# EAGLE design programmer_pcb2 (EAGLE 9.6.2)
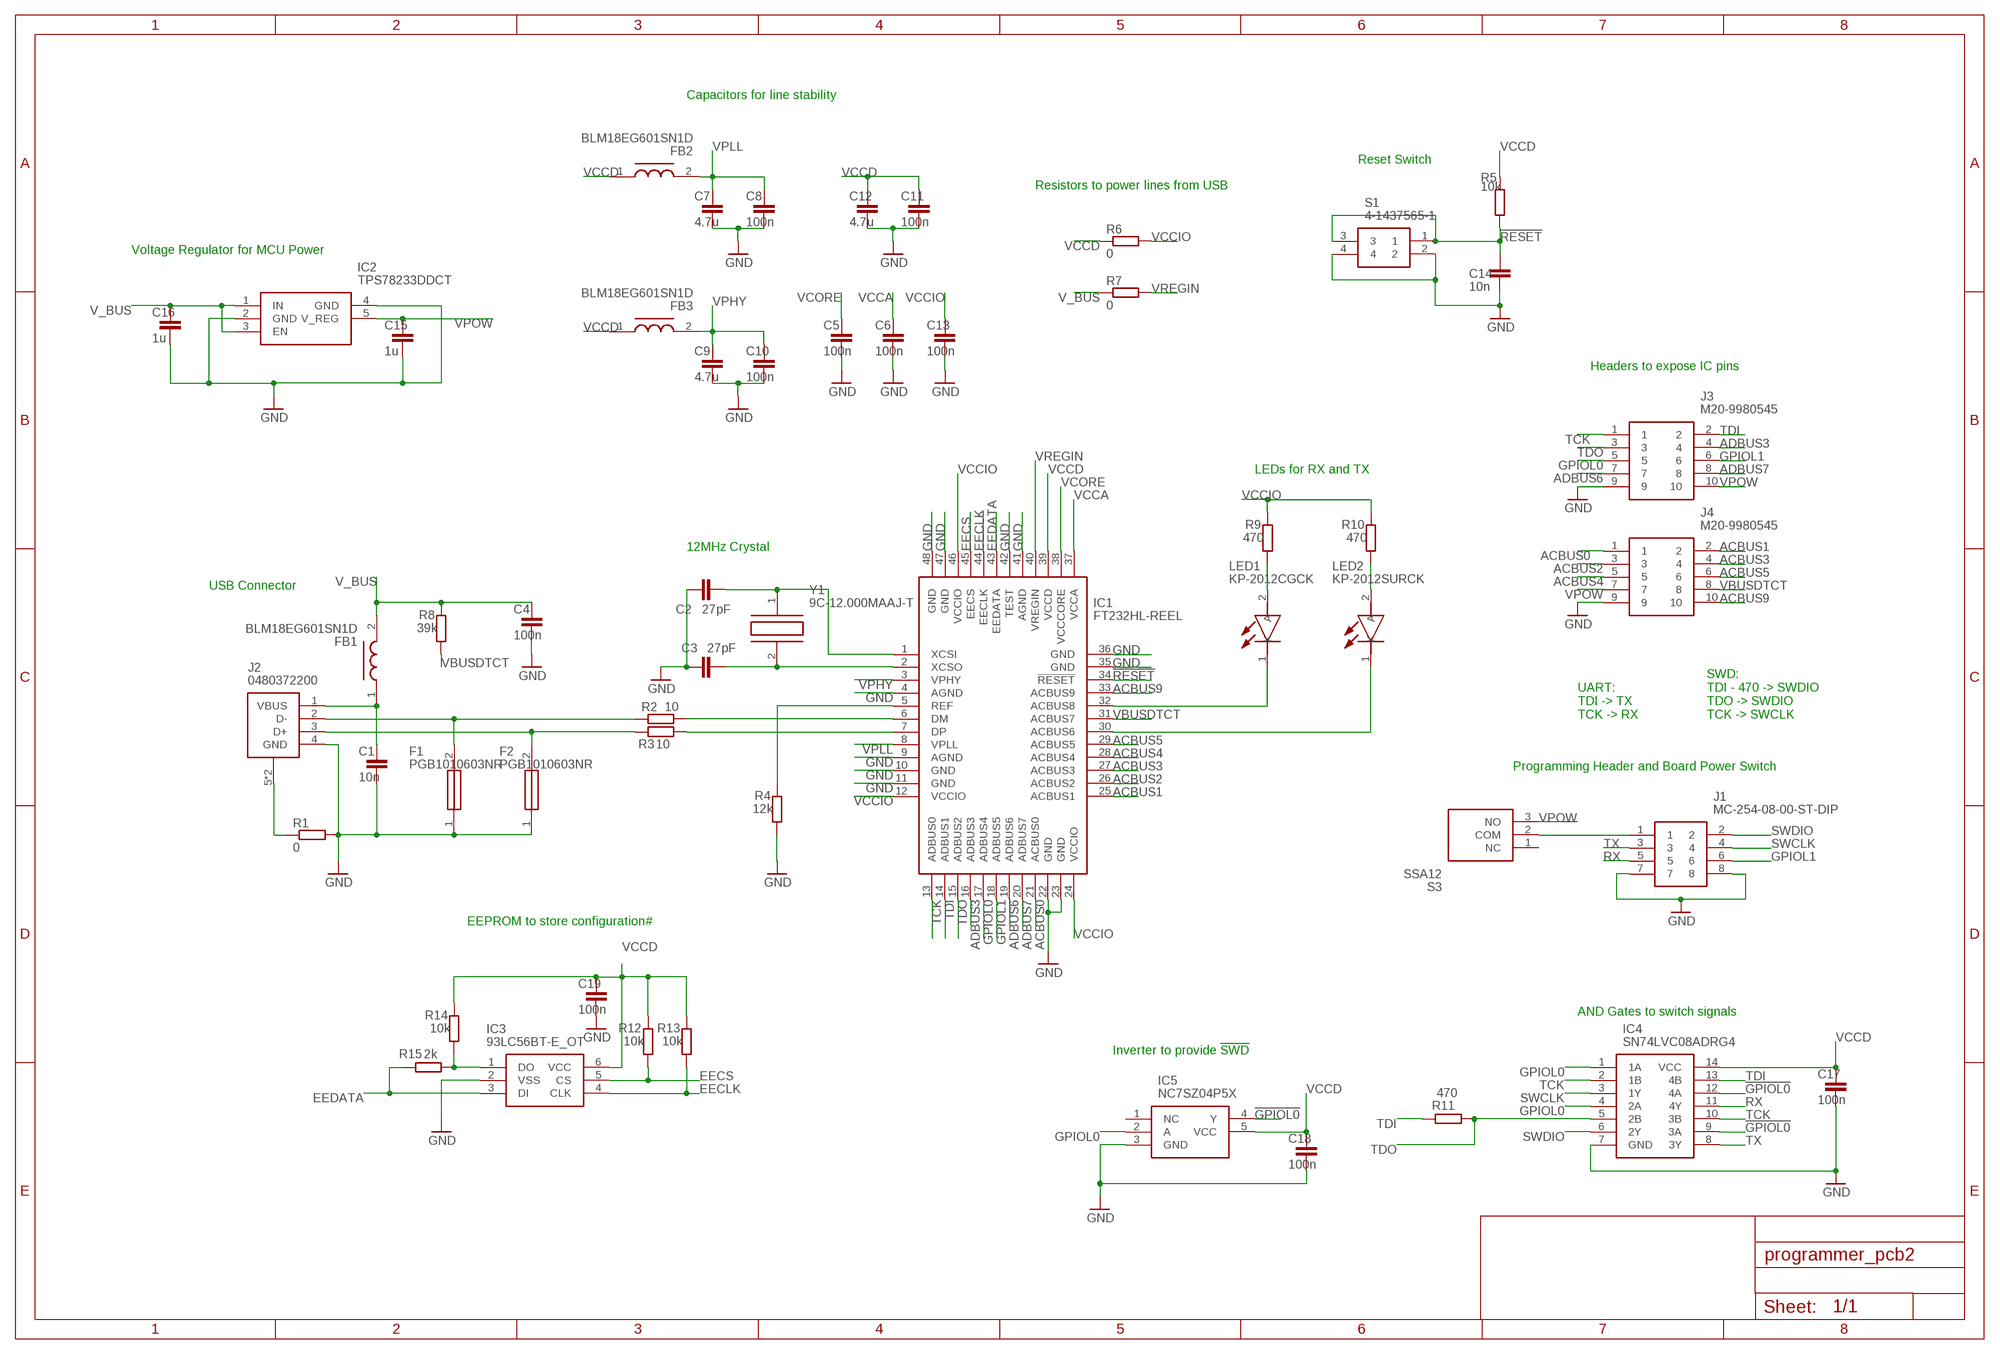
[diagram p0: schematic, sheet 1]

## Parts
C1  10n  C-EUC0805  [C0805]
C2  27pF  C-EUC0805  [C0805]
C3  27pF  C-EUC0805  [C0805]
C4  100n  C-EUC0805  [C0805]
C5  100n  C-EUC0805  [C0805]
C6  100n  C-EUC0805  [C0805]
C7  4.7u  C-EUC0805  [C0805]
C8  100n  C-EUC0805  [C0805]
C9  4.7u  C-EUC0805  [C0805]
C10  100n  C-EUC0805  [C0805]
C11  100n  C-EUC0805  [C0805]
C12  4.7u  C-EUC0805  [C0805]
C13  100n  C-EUC0805  [C0805]
C14  10n  C-EUC0805  [C0805]
C15  1u  C-EUC0805  [C0805]
C16  1u  C-EUC0805  [C0805]
C17  100n  C-EUC0805  [C0805]
C18  100n  C-EUC0805  [C0805]
C19  100n  C-EUC0805  [C0805]
F1  PGB1010603NR  [FUSC1708X36N]
F2  PGB1010603NR  [FUSC1708X36N]
FB1  BLM18EG601SN1D  [BLM18EG121SH1D]
FB2  BLM18EG601SN1D  [BLM18EG121SH1D]
FB3  BLM18EG601SN1D  [BLM18EG121SH1D]
IC1  FT232HL-REEL  [QFP50P900X900X160-48N]
IC2  TPS78233DDCT  [SOT95P280X110-5N]
IC3  93LC56BT-E_OT  [SOT95P270X145-6N]
IC4  SN74LVC08ADRG4  [SOIC127P600X175-14N]
IC5  NC7SZ04P5X  [SOT65P210X110-5N]
J1  MC-254-08-00-ST-DIP  [MC2540800STDIP]
J2  0480372200  [0480372200]
J3  M20-9980545  [HDRV10W80P254_2X5_1270X508X864]
J4  M20-9980545  [HDRV10W80P254_2X5_1270X508X864]
LED1  KP-2012CGCK  [LEDC2012X110N]
LED2  KP-2012SURCK  [LEDC2012X110N]
R1  0  R-EU_R0603  [R0603]
R2  10  R-EU_R0603  [R0603]
R3  10  R-EU_R0603  [R0603]
R4  12k  R-EU_R0603  [R0603]
R5  10k  R-EU_R0603  [R0603]
R6  0  R-EU_R0603  [R0603]
R7  0  R-EU_R0603  [R0603]
R8  39k  R-EU_R0603  [R0603]
R9  470  R-EU_R0603  [R0603]
R10  470  R-EU_R0603  [R0603]
R11  470  R-EU_R0603  [R0603]
R12  10k  R-EU_R0603  [R0603]
R13  10k  R-EU_R0603  [R0603]
R14  10k  R-EU_R0603  [R0603]
R15  2k  R-EU_R0603  [R0603]
S1  4-1437565-1  [FSM-SWITCH]
S3  SSA12  [SSA12]
Y1  9C-12.000MAAJ-T  [SMD-HC-49-S]

## Nets
!GPIOL0: IC4.9(3A) IC4.12(4A) IC5.4(Y)
!RESET: C14.1 IC1.34(!RESET) R5.1 S1.1 S1.3
ACBUS0: IC1.21(ACBUS0) J4.1
ACBUS1: IC1.25(ACBUS1) J4.2
ACBUS2: IC1.26(ACBUS2) J4.3
ACBUS3: IC1.27(ACBUS3) J4.4
ACBUS4: IC1.28(ACBUS4) J4.5
ACBUS5: IC1.29(ACBUS5) J4.6
ACBUS9: IC1.33(ACBUS9) J4.10
ADBUS3: IC1.16(ADBUS3) J3.4
ADBUS6: IC1.19(ADBUS6) J3.7
ADBUS7: IC1.20(ADBUS7) J3.8
EECLK: IC1.44(EECLK) IC3.4(CLK) R13.1
EECS: IC1.45(EECS) IC3.5(CS) R12.1
EEDATA: IC1.43(EEDATA) IC3.3(DI) R15.1
GND: C1.2 C2.1 C3.1 C4.2 C5.2 C6.2 C7.2 C8.2 C9.2 C10.2 C11.2 C12.2 C13.2 C14.2 C15.2 C16.2 C17.2 C18.2 C19.2 F1.1 F2.1 IC1.4(AGND) IC1.9(AGND) IC1.10(GND) IC1.11(GND) IC1.22(GND) IC1.23(GND) IC1.35(GND) IC1.36(GND) IC1.41(AGND) IC1.42(TEST) IC1.47(GND) IC1.48(GND) IC2.2(GND) IC2.4(GND) IC3.2(VSS) IC4.7(GND) IC5.3(GND) J1.7 J1.8 J2.4(GND) J3.9 J4.9 R1.2 R4.1 S1.2 S1.4
GPIOL0: IC1.17(ADBUS4) IC4.1(1A) IC4.4(2A) IC5.2(A) J3.5
GPIOL1: IC1.18(ADBUS5) J1.6 J3.6
N$1: J2.5(SLD) J2.6(SLD) R1.1
N$2: C1.1 FB1.1 J2.1(VBUS)
N$3: F1.2 J2.2(D-) R2.1
N$4: F2.2 J2.3(D+) R3.1
N$5: IC1.7(DP) R3.2
N$6: IC1.6(DM) R2.2
N$7: C2.2 IC1.1(XCSI) Y1.1
N$8: C3.2 IC1.2(XCSO) Y1.2
N$9: IC1.5(REF) R4.2
N$11: J1.1 S3.2(COM)
N$12: IC1.30(ACBUS6) LED2.1(K)
N$14: IC1.32(ACBUS8) LED1.1(K)
N$15: LED1.2(A) R9.1
N$16: LED2.2(A) R10.1
N$20: IC3.1(DO) R14.1 R15.2
RX: IC4.11(4Y) J1.5
SWCLK: IC4.3(1Y) J1.4
SWDIO: IC4.6(2Y) J1.2
TCK: IC1.13(ADBUS0) IC4.2(1B) IC4.10(3B) J3.1
TDI: IC1.14(ADBUS1) IC4.13(4B) J3.2 R11.1
TDO: IC1.15(ADBUS2) IC4.5(2B) J3.3 R11.2
TX: IC4.8(3Y) J1.3
V_BUS: C4.1 C16.1 FB1.2 IC2.1(IN) IC2.3(EN) R7.1 R8.2
VBUSDTCT: IC1.31(ACBUS7) J4.8 R8.1
VCCA: C6.1 IC1.37(VCCA)
VCCD: C11.1 C12.1 C17.1 C18.1 C19.1 FB2.1 FB3.1 IC1.39(VCCD) IC3.6(VCC) IC4.14(VCC) IC5.5(VCC) R5.2 R6.1 R12.2 R13.2 R14.2
VCCIO: C13.1 IC1.12(VCCIO) IC1.24(VCCIO) IC1.46(VCCIO) R6.2 R9.2 R10.2
VCORE: C5.1 IC1.38(VCCCORE)
VPHY: C9.1 C10.1 FB3.2 IC1.3(VPHY)
VPLL: C7.1 C8.1 FB2.2 IC1.8(VPLL)
VPOW: C15.1 IC2.5(V_REG) J3.10 J4.7 S3.3(NO)
VREGIN: IC1.40(VREGIN) R7.2
Unconnected: IC5.1(NC) S3.1(NC)

## Notes on the sheet
- Capacitors for line stability
- Reset Switch
- Resistors to power lines from USB
- Voltage Regulator for MCU Power
- Headers to expose IC pins
- LEDs for RX and TX
- 12MHz Crystal
- USB Connector
- UART: 
  TDI -> TX
  TCK -> RX
- SWD:
  TDI - 470 -> SWDIO
  TDO -> SWDIO
  TCK -> SWCLK
- Programming Header and Board Power Switch
- EEPROM to store configuration#
- AND Gates to switch signals
- Inverter to provide !SWD

## Library data of the parts
C1-C19 = rcl:C-EU: CAPACITOR, European symbol; SPICEPREFIX: C
F1 F2 = SamacSys_Parts:PGB1010603NR: Suppressor Pulseguard 0603 ESD 24Vdc PG Littelfuse 24 V dc PGB1 ESD Suppressor, Surface Mount Mounting Source: Datasheet <https://componentsearchengine.com/Datasheets/2/PGB1010603NR.pdf>; ARROW_PART_NUMBER: PGB1010603NR; ARROW_PRICE-STOCK: https://www.arrow.com/en/products/pgb1010603nr/littelfuse; DESCRIPTION: Suppressor Pulseguard 0603 ESD 24Vdc PG Littelfuse 24 V dc PGB1 ESD Suppressor, Surface Mount Mounting; HEIGHT: 0.36mm; MANUFACTURER_NAME: LITTELFUSE; MANUFACTURER_PART_NUMBER: PGB1010603NR; MOUSER_PART_NUMBER: 576-PGB1010603NR; MOUSER_PRICE-STOCK: https://www.mouser.co.uk/ProductDetail/Littelfuse/PGB1010603NR?qs=gu7KAQ731UTJOoBJUwB8FA%3D%3D
FB1-FB3 = SamacSys_Parts:BLM18EG601SN1D: Murata Ferrite Bead (Chip Ferrite Bead), 1.6 x 0.8 x 0.8mm (0603), 600 impedance at 100 MHz Source: Datasheet <https://componentsearchengine.com/Datasheets/1/BLM18EG601SN1D.pdf>; DESCRIPTION: Murata Ferrite Bead (Chip Ferrite Bead), 1.6 x 0.8 x 0.8mm (0603), 600 impedance at 100 MHz; HEIGHT: 0.95mm; MANUFACTURER_NAME: Murata Electronics; MANUFACTURER_PART_NUMBER: BLM18EG601SN1D; MOUSER_PART_NUMBER: 81-BLM18EG601SN1D; MOUSER_PRICE-STOCK: https://www.mouser.com/Search/Refine.aspx?Keyword=81-BLM18EG601SN1D
IC1 = SamacSys_Parts:FT232HL-REEL: USB 2.0 to UART/FIFO Interface, LQFP48 FTDI Chip FT232HL-REEL Universal Asynchronous Receiver & Transmitter RS232, RS422, RS485 UART 12Mbit/s, 1.8 V, 3.3 V Source: Datasheet <http://www.ftdichip.com/Support/Documents/DataSheets/ICs/DS_FT232H.pdf>; DESCRIPTION: USB 2.0 to UART/FIFO Interface, LQFP48 FTDI Chip FT232HL-REEL Universal Asynchronous Receiver & Transmitter RS232, RS422, RS485 UART 12Mbit/s, 1.8 V, 3.3 V; HEIGHT: 1.6mm; MANUFACTURER_NAME: FTDI Chip; MANUFACTURER_PART_NUMBER: FT232HL-REEL; MOUSER_PART_NUMBER: 895-FT232HL-REEL; MOUSER_PRICE-STOCK: https://www.mouser.co.uk/ProductDetail/FTDI/FT232HL-REEL?qs=rzPzygjq8vIanTFlYsBQCw%3D%3D
IC2 = SamacSys_Parts:TPS78233DDCT: TPS78233DDCT, Low Dropout Voltage Regulator, 0.15A, 3.3V +/-2%, 2.2 to 5.5Vin, 0.5W, 5-Pin SOT Source: Datasheet <http://www.ti.com/lit/ds/symlink/tps78233.pdf>; DESCRIPTION: TPS78233DDCT, Low Dropout Voltage Regulator, 0.15A, 3.3V +/-2%, 2.2 to 5.5Vin, 0.5W, 5-Pin SOT; HEIGHT: 1.1mm; MANUFACTURER_NAME: Texas Instruments; MANUFACTURER_PART_NUMBER: TPS78233DDCT; MOUSER_PART_NUMBER: 595-TPS78233DDCT; MOUSER_PRICE-STOCK: https://www.mouser.co.uk/ProductDetail/Texas-Instruments/TPS78233DDCT?qs=IDSsxkoac0yhGoy0%252BR8zmA%3D%3D
IC3 = SamacSys_Parts:93LC56BT-E_OT: Microchip 93LC56BT-E/OT, 2kbit EEPROM Memory, 400ns 6-Pin SOT-23 Serial-Microwire Source: Datasheet <http://ww1.microchip.com/downloads/en/devicedoc/21794g.pdf>; ARROW_PART_NUMBER: 93LC56BT-E/OT; ARROW_PRICE-STOCK: https://www.arrow.com/en/products/93lc56bt-eot/microchip-technology; DESCRIPTION: Microchip 93LC56BT-E/OT, 2kbit EEPROM Memory, 400ns 6-Pin SOT-23 Serial-Microwire; HEIGHT: 1.45mm; MANUFACTURER_NAME: Microchip; MANUFACTURER_PART_NUMBER: 93LC56BT-E/OT; MOUSER_PART_NUMBER: 579-93LC56BT-E/OT; MOUSER_PRICE-STOCK: https://www.mouser.co.uk/ProductDetail/Microchip-Technology/93LC56BT-E-OT?qs=mKuojOqe%252BqOr0HXN84QqHA%3D%3D
IC4 = SamacSys_Parts:SN74LVC08ADRG4: Quadruple 2-Input Positive-AND Gate Source: Datasheet <http://www.ti.com/lit/gpn/SN74LVC08A>; ARROW_PART_NUMBER: SN74LVC08ADRG4; ARROW_PRICE-STOCK: https://www.arrow.com/en/products/sn74lvc08adrg4/texas-instruments; DESCRIPTION: Quadruple 2-Input Positive-AND Gate; HEIGHT: 1.75mm; MANUFACTURER_NAME: Texas Instruments; MANUFACTURER_PART_NUMBER: SN74LVC08ADRG4; MOUSER_PART_NUMBER: 595-SN74LVC08ADRG4; MOUSER_PRICE-STOCK: https://www.mouser.com/Search/Refine.aspx?Keyword=595-SN74LVC08ADRG4
IC5 = SamacSys_Parts:NC7SZ04P5X: Inverter 1 Channel CMOS 5 Pin SC-70 Source: Datasheet <http://docs-emea.rs-online.com/webdocs/0f9b/0900766b80f9b618.pdf>; ARROW_PART_NUMBER: NC7SZ04P5X; ARROW_PRICE-STOCK: https://www.arrow.com/en/products/nc7sz04p5x/on-semiconductor; DESCRIPTION: Inverter 1 Channel CMOS 5 Pin SC-70; HEIGHT: 1.1mm; MANUFACTURER_NAME: ON Semiconductor; MANUFACTURER_PART_NUMBER: NC7SZ04P5X; MOUSER_PART_NUMBER: 512-NC7SZ04P5X; MOUSER_PRICE-STOCK: https://www.mouser.co.uk/ProductDetail/ON-Semiconductor-Fairchild/NC7SZ04P5X?qs=CR8BwU6haLeoOKbTbWr5WQ%3D%3D
J1 = SamacSys_Parts:MC-254-08-00-ST-DIP: CONNECTOR, HEADER, 8POS, 2ROW, 2.54MM; Pitch Spacing:2.54mm; No. of Contacts:8Contacts; Gender:Header; Product Range:-; Contact Termination Type:Through Hole; No. of Rows:2Rows; Contact Plating:Gold Plated Contacts RoHS Compliant: Yes Source: Datasheet <https://componentsearchengine.com/Datasheets/2/MC-254-08-00-ST-DIP.pdf>; ARROW_PART_NUMBER: MC-254-08-00-ST-DIP; DESCRIPTION: CONNECTOR, HEADER, 8POS, 2ROW, 2.54MM; Pitch Spacing:2.54mm; No. of Contacts:8Contacts; Gender:Header; Product Range:-; Contact Termination Type:Through Hole; No. of Rows:2Rows; Contact Plating:Gold Plated Contacts RoHS Compliant: Yes; HEIGHT: 9.1mm; MANUFACTURER_NAME: MULTICOMP; MANUFACTURER_PART_NUMBER: MC-254-08-00-ST-DIP
J2 = SamacSys_Parts:0480372200: CONN PLUG USB A 4POS SMD R/A Source: Datasheet <https://www.molex.com/pdm_docs/sd/480372200_sd.pdf>; ARROW_PART_NUMBER: 0480372200; ARROW_PRICE-STOCK: https://www.arrow.com/en/products/0480372200/molex; DESCRIPTION: CONN PLUG USB A 4POS SMD R/A; HEIGHT: 4mm; MANUFACTURER_NAME: Molex; MANUFACTURER_PART_NUMBER: 0480372200; MOUSER_PART_NUMBER: N/A; MOUSER_PRICE-STOCK: https://www.mouser.co.uk/ProductDetail/Molex/0480372200?qs=PBcRNPEHKspH5weIJRN3iw%3D%3D
J3 J4 = SamacSys_Parts:M20-9980545: M20 Header, Pin, Dil, Vertical, 5+5 W HARWIN M20 Series, 2.54mm Pitch 10 Way 2 Row Straight Pin Header, Through Hole, Solder Termination Source: Datasheet <https://componentsearchengine.com/Datasheets/2/M20-9980545.pdf>; ARROW_PART_NUMBER: M20-9980545; DESCRIPTION: M20 Header, Pin, Dil, Vertical, 5+5 W HARWIN M20 Series, 2.54mm Pitch 10 Way 2 Row Straight Pin Header, Through Hole, Solder Termination; HEIGHT: 8.64mm; MANUFACTURER_NAME: Harwin; MANUFACTURER_PART_NUMBER: M20-9980545; MOUSER_PART_NUMBER: 855-M20-9980545; MOUSER_PRICE-STOCK: https://www.mouser.co.uk/ProductDetail/Harwin/M20-9980545?qs=%252Bk6%2F5FB6qrlY8xJEYbERXQ%3D%3D
LED1 = SamacSys_Parts:KP-2012CGCK: Green Chip LED 2.0x1.25mm Kingbright KP-2012CGCK Green LED, 570 nm, 2012 (0805), Rectangle Lens SMD Package Source: Datasheet <https://componentsearchengine.com/Datasheets/2/KP-2012CGCK.pdf>; DESCRIPTION: Green Chip LED 2.0x1.25mm Kingbright KP-2012CGCK Green LED, 570 nm, 2012 (0805), Rectangle Lens SMD Package; HEIGHT: 1.1mm; MANUFACTURER_NAME: Kingbright; MANUFACTURER_PART_NUMBER: KP-2012CGCK; MOUSER_PART_NUMBER: N/A; MOUSER_PRICE-STOCK: https://www.mouser.com/Search/Refine.aspx?Keyword=N%2FA; RS_PART_NUMBER: 8610037P; RS_PRICE-STOCK: http://uk.rs-online.com/web/p/products/8610037P
LED2 = SamacSys_Parts:KP-2012SURCK: Red Chip LED 2.0x1.25mm Kingbright KPT-2012SURCK Red LED, 2012 (0805), Rectangle Lens SMD Package; DESCRIPTION: Green Chip LED 2.0x1.25mm Kingbright KP-2012CGCK Green LED, 570 nm, 2012 (0805), Rectangle Lens SMD Package; HEIGHT: 1.1mm; MANUFACTURER_NAME: Kingbright; MANUFACTURER_PART_NUMBER: KP-2012CGCK; MOUSER_PART_NUMBER: N/A; MOUSER_PRICE-STOCK: https://www.mouser.com/Search/Refine.aspx?Keyword=N%2FA; RS_PART_NUMBER: 8610037P; RS_PRICE-STOCK: http://uk.rs-online.com/web/p/products/8610037P
R1-R15 = rcl:R-EU_: RESISTOR, European symbol; SPICEPREFIX: R
S1 = SamacSys_Parts:4-1437565-1: 6x6mm SMD tactile switch,5mm H 1.6N Black Button Tactile Switch, SPST-NO 0.05 A@ 12 V dc 1.4mm Source: Datasheet <http://uk.rs-online.com/web/p/products/4791508P>; ALLIED_NUMBER: R1117787; DESCRIPTION: 6x6mm SMD tactile switch,5mm H 1.6N Black Button Tactile Switch, SPST-NO 0.05 A@ 12 V dc 1.4mm; HEIGHT: mm; MANUFACTURER_NAME: TE Connectivity; MANUFACTURER_PART_NUMBER: 4-1437565-1; RS_PART_NUMBER: 4791508P; RS_PRICE-STOCK: http://uk.rs-online.com/web/p/products/4791508P
S3 = SamacSys_Parts:SSA12: Slide switch,PCB,SPDT,2 pos,vertical mnt Source: Datasheet <http://uk.rs-online.com/web/p/products/7182326P>; ALLIED_NUMBER: 70155886; DESCRIPTION: Slide switch,PCB,SPDT,2 pos,vertical mnt; HEIGHT: 5.664mm; MANUFACTURER_NAME: TE Connectivity; MANUFACTURER_PART_NUMBER: SSA12; RS_PART_NUMBER: 7182326P; RS_PRICE-STOCK: http://uk.rs-online.com/web/p/products/7182326P
Y1 = SamacSys_Parts:9C-12.000MAAJ-T: TXC - 9C-8.000MAAJ-T - XTAL, 8.000MHZ, 18PF, SMD, HC-49S Source: Datasheet <http://www.txccrystal.com/images/pdf/9c.pdf>; ARROW_PART_NUMBER: 9C-8.000MAAJ-T; ARROW_PRICE-STOCK: https://www.arrow.com/en/products/9c-8.000maaj-t/txc-corporation; DESCRIPTION: TXC - 9C-8.000MAAJ-T - XTAL, 8.000MHZ, 18PF, SMD, HC-49S; HEIGHT: mm; MANUFACTURER_NAME: TXC; MANUFACTURER_PART_NUMBER: 9C-8.000MAAJ-T; MOUSER_PART_NUMBER: 717-9C-8.000MAAJ-T; MOUSER_PRICE-STOCK: https://www.mouser.co.uk/ProductDetail/TXC-Corporation/9C-8000MAAJ-T?qs=65dIHZNch5tkz4amJINljg%3D%3D

## Board
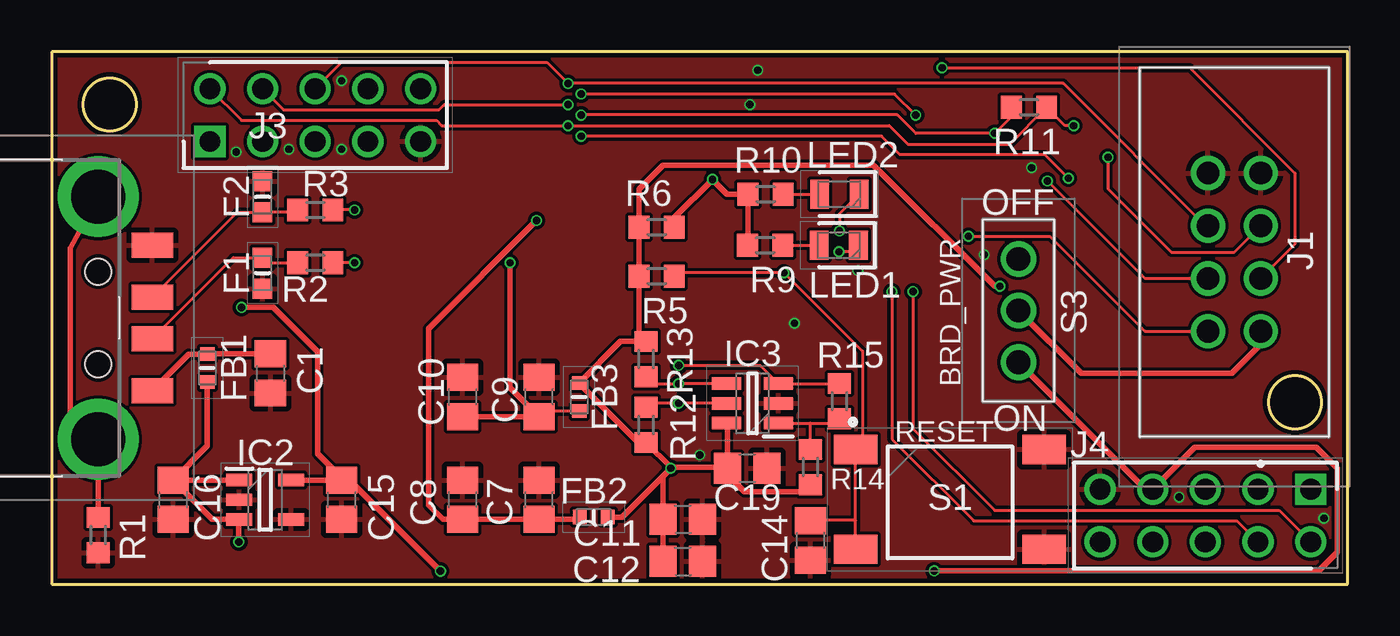
[diagram p1: board, top side]
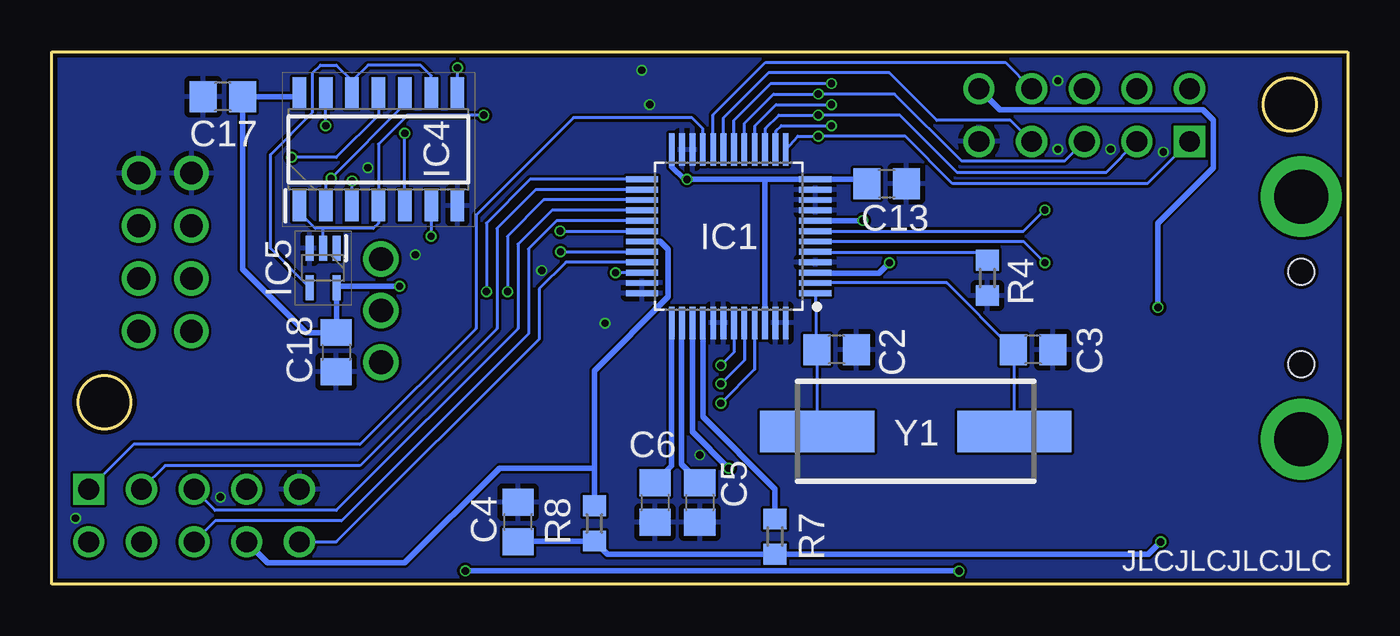
[diagram p2: board, bottom side, seen from below]

Size 62.48 x 25.65 mm. Coordinates in mm from the lower left corner, seen from the top.
Outline: 0,25.65 0,0 62.48,0 62.48,25.65 0,25.65
Outline: circle at 2.79,23.11 radius 1.27
Outline: circle at 59.94,8.76 radius 1.27
Copper layers (1*16): Top 0.035559375mm / dielectric 1.6mm / Bottom 0.035559375mm
Design rules "jlcpcb2layer": minimum track width 5mil, minimum drill 12mil, track to track 5mil, track to pad 5mil, pad to pad 5mil, via to via 5mil, smd to smd 5mil, copper to edge 8mil, drill to drill 6mil, minimum pad ring 5mil, minimum via ring 3mil, stop-mask expansion 2.5mil, vias tented up to drill 0mil, thermal gap 10mil

### Footprints (pad centres in the part's own frame; a part is rotated, then mirrored left to right if it is on the bottom)
C0805 = smd 1.3 x 1.5: 1 -0.95,0; 2 0.95,0
FUSC1708X36N = smd 0.97 x 0.94: 1 -0.75,0; 2 0.75,0
BLM18EG121SH1D = smd 0.65 x 0.7: 1 -0.675,0; 2 0.675,0
QFP50P900X900X160-48N = smd 1.559 x 0.28: 1 -4.178,2.75; 2 -4.178,2.25; 3 -4.178,1.75; 4 -4.178,1.25; 5 -4.178,0.75; 6 -4.178,0.25; 7 -4.178,-0.25; 8 -4.178,-0.75; 9 -4.178,-1.25; 10 -4.178,-1.75; 11 -4.178,-2.25; 12 -4.178,-2.75; 25 4.178,-2.75; 26 4.178,-2.25; 27 4.178,-1.75; 28 4.178,-1.25; 29 4.178,-0.75; 30 4.178,-0.25; 31 4.178,0.25; 32 4.178,0.75; 33 4.178,1.25; 34 4.178,1.75; 35 4.178,2.25; 36 4.178,2.75 | smd 0.28 x 1.559: 13 -2.75,-4.178; 14 -2.25,-4.178; 15 -1.75,-4.178; 16 -1.25,-4.178; 17 -0.75,-4.178; 18 -0.25,-4.178; 19 0.25,-4.178; 20 0.75,-4.178; 21 1.25,-4.178; 22 1.75,-4.178; 23 2.25,-4.178; 24 2.75,-4.178; 37 2.75,4.178; 38 2.25,4.178; 39 1.75,4.178; 40 1.25,4.178; 41 0.75,4.178; 42 0.25,4.178; 43 -0.25,4.178; 44 -0.75,4.178; 45 -1.25,4.178; 46 -1.75,4.178; 47 -2.25,4.178; 48 -2.75,4.178
SOT95P280X110-5N = smd 1.25 x 0.6: 1 -1.25,0.95; 2 -1.25,0; 3 -1.25,-0.95; 4 1.25,-0.95; 5 1.25,0.95
SOT95P270X145-6N = smd 1.4 x 0.6: 1 -1.25,0.95; 2 -1.25,0; 3 -1.25,-0.95; 4 1.25,-0.95; 5 1.25,0; 6 1.25,0.95
SOIC127P600X175-14N = smd 1.525 x 0.65: 1 -2.712,3.81; 2 -2.712,2.54; 3 -2.712,1.27; 4 -2.712,0; 5 -2.712,-1.27; 6 -2.712,-2.54; 7 -2.712,-3.81; 8 2.712,-3.81; 9 2.712,-2.54; 10 2.712,-1.27; 11 2.712,0; 12 2.712,1.27; 13 2.712,2.54; 14 2.712,3.81
SOT65P210X110-5N = smd 1.2 x 0.4: 1 -0.95,0.65; 2 -0.95,0; 3 -0.95,-0.65; 4 0.95,-0.65; 5 0.95,0.65
MC2540800STDIP = drill 1.1 pad 1.65: 1 0,0; 2 0,2.54; 3 2.54,0; 4 2.54,2.54; 5 5.08,0; 6 5.08,2.54; 7 7.62,0; 8 7.62,2.54
0480372200 = smd 1.2 x 2: 1 3.5,10.175; 2 1,10.175; 3 -1,10.175; 4 -3.5,10.175 | drill 2.596 pad 3.894: 5 -5.85,7.575; 6 5.85,7.575 | hole 1.25: 2.235,7.569; -2.235,7.569
HDRV10W80P254_2X5_1270X508X864 = drill 1 pad 1.5 square: 1 0,0 | drill 1 pad 1.5: 2 0,2.54; 3 2.54,0; 4 2.54,2.54; 5 5.08,0; 6 5.08,2.54; 7 7.62,0; 8 7.62,2.54; 9 10.16,0; 10 10.16,2.54
LEDC2012X110N = smd 0.9 x 1.4: 1 -0.95,0; 2 0.95,0
R0603 = smd 1 x 1.1: 1 -0.85,0; 2 0.85,0
FSM-SWITCH = smd 1.4 x 2.1: 1 2.55,4.55; 2 2.55,-4.55; 3 -2.25,4.55; 4 -2.25,-4.55
SSA12 = drill 1.143 pad 1.715: 1 0,0; 2 2.489,0; 3 4.978,0
SMD-HC-49-S = smd 5.5 x 2: 1 -4.75,0; 2 4.75,0

### Placement (x,y rotation side)
C1  10.54,10.16 270 top
C2  24.64,11.3 180 bottom
C3  15.16,11.3 180 bottom
C4  40.01,3 90 bottom
C5  31.24,3.94 270 bottom
C6  33.4,3.94 270 bottom
C7  23.5,4.06 90 top
C8  19.81,4.06 90 top
C9  23.5,9.02 90 top
C10  19.81,9.02 90 top
C11  30.43,3.12 0 top
C12  30.43,1.09 0 top
C13  22.23,19.3 0 bottom
C14  36.58,2.11 270 top
C15  13.97,4.06 270 top
C16  5.84,4.06 270 top
C17  54.23,23.5 180 bottom
C18  48.77,11.18 270 bottom
C19  33.53,5.59 0 top
F1  10.16,14.99 90 top
F2  10.16,18.67 270 top
FB1  7.49,10.41 270 top
FB2  26.14,3.23 180 top
FB3  25.43,9.02 270 top
IC1  29.84,16.76 180 bottom
IC2  10.29,4.06 0 top
IC3  33.78,8.71 180 top
IC4  46.74,20.95 90 bottom
IC5  49.4,15.24 270 bottom
J1  58.29,12.19 90 top
J2  -5.33,12.83 270 top
J3  7.62,21.34 0 top
J4  60.71,4.57 180 top
LED1  37.95,16.33 180 top
LED2  37.97,18.8 180 top
R1  2.24,2.36 270 top
R2  12.7,15.49 0 top
R3  12.7,18.03 0 top
R4  17.37,14.76 90 bottom
R5  29.16,14.83 180 top
R6  29.16,17.2 0 top
R7  27.61,2.29 90 bottom
R8  36.32,2.92 270 bottom
R9  34.39,16.33 180 top
R10  34.42,18.8 180 top
R11  47.12,22.99 180 top
R12  28.65,7.67 270 top
R13  28.65,10.85 90 top
R14  36.58,5.64 270 top
R15  37.97,8.81 270 top
S1  43.31,3.94 90 top
S3  46.61,15.67 270 top
Y1  20.83,7.37 0 bottom

### Tracks (layer width: path | path; a pad name or v marks a point on that pad's centre or on a via)
!GPIOL0
  Bottom 0.152: IC5.4 51.94,16.18 51.94,20.7 49.91,22.73 49.91,24.64 49.53,25.02 48.77,25.02 48.01,24.26 | 48.01,24.26 IC4.12 | IC4.9 44.2,24.51 44.7,25.02 47.24,25.02 48.01,24.26
!RESET  (via drill 0.35)
  Top 0.152: S1.3 38.76,3.07 | 38.76,3.07 S1.1 39.09,6.82 39.09,11.23 v35.31,15.01 30.19,15.01 R5.1 | 38.76,3.07 36.59,3.07 C14.1
  Bottom 0.152: IC1.34 v35.3,15.01 v35.31,15.01
ACBUS0
  Bottom 0.152: IC1.21 31.09,21.95 31.62,22.48 37.34,22.48 42.04,17.78 42.04,12.32 47.62,6.73 58.55,6.73 J4.1
ACBUS1  (via drill 0.35)
  Top 0.152: v41.53,14.1 41.53,7.49 45.47,3.56 59.18,3.56 J4.2
  Bottom 0.152: IC1.25 39.41,19.51 41.53,17.4 v41.53,14.1
ACBUS2
  Bottom 0.152: IC1.26 39.15,19.01 41.02,17.14 41.02,12.32 47.62,5.71 57.02,5.71 J4.3
ACBUS3  (via drill 0.35)
  Top 0.152: v40.51,14.1 40.51,6.99 44.45,3.05 57.15,3.05 J4.4
  Bottom 0.152: IC1.27 38.76,18.51 40.51,16.76 v40.51,14.1
ACBUS4
  Bottom 0.152: IC1.28 38.37,18.01 40.01,16.38 40.01,12.32 48.77,3.56 54.61,3.56 J4.5
ACBUS5
  Bottom 0.152: IC1.29 38.14,17.51 39.5,16.15 39.5,12.06 48.51,3.05 54.61,3.05 J4.6
ACBUS9
  Bottom 0.152: IC1.33 37.7,15.51 38.99,14.22 38.99,11.81 48.77,2.03 J4.10
ADBUS3  (via drill 0.35)
  Top 0.152: J3.4 11.18,22.86 18.67,22.86 18.92,23.11 v24.89,23.11
  Bottom 0.152: IC1.16 28.57,21.02 28.57,22.1 27.56,23.11 v24.89,23.11
ADBUS6
  Bottom 0.152: IC1.19 30.09,22.48 27.94,24.64 22.1,24.64 19.81,22.35 16.26,22.35 J3.7
ADBUS7
  Bottom 0.152: IC1.20 30.59,22.62 28.07,25.15 16.51,25.15 J3.8
EECLK  (via drill 0.35)
  Top 0.152: IC3.4 v30.23,9.65 29.01,9.65 28.66,10 R13.1
  Bottom 0.152: v30.23,9.65 29.09,10.78 IC1.44
EECS  (via drill 0.35)
  Top 0.152: IC3.5 v30.23,8.71 28.84,8.71 R12.1
  Bottom 0.152: v30.23,8.71 28.59,10.34 IC1.45
EEDATA  (via drill 0.35)
  Top 0.152: v30.23,10.54 34.15,10.54 IC3.3 R15.1
  Bottom 0.152: v30.23,10.54 29.59,11.17 IC1.43
GND  (via drill 0.35)
  other vias: 35.81,12.57 34.04,24.77 33.66,23.11 61.34,3.17 13.97,24.26 44.96,15.88 54.36,4.19 8.89,20.83 11.43,20.95 13.97,20.95 47.24,20.07 38.86,15.11 31.24,6.22
  pour Top (isolate 0.152): -17.02,-5.21 -17.02,53.34 106.68,53.34 106.68,-5.21
  pour Bottom: -18.54,-5.59 -18.54,39.88 78.74,39.88 78.74,-5.59
GPIOL0  (via drill 0.35)
  Top 0.152: v41.66,22.61 40.64,23.62 v25.53,23.62
  Bottom 0.152: IC1.17 29.08,21.01 29.08,22.23 27.69,23.62 v25.53,23.62 21.84,23.62 18.61,20.38 13.65,20.38 J3.5 | v41.66,22.61 45.34,22.61 46.74,21.21 IC4.4 46.74,17.4 46.99,17.14 49.4,17.14 | 49.4,17.14 49.78,17.14 50.55,17.91 IC4.1 | IC5.2 49.4,17.14
GPIOL1  (via drill 0.35)
  Top 0.152: J3.6 13.97,25.15 23.88,25.15 v24.89,24.13 48.77,24.13 55.63,17.27 J1.6
  Bottom 0.152: IC1.18 29.59,22.35 27.81,24.13 v24.89,24.13
N$1
  Top 0.254: R1.1 2.23,5.83 J2.6 2.24,6.78 0.89,8.13 0.89,16.18 J2.5
N$2
  Top 0.254: C1.1 7.51,11.11 FB1.1 6.6,11.09 J2.1
N$3
  Top 0.152: R2.1 10.4,15.49 F1.2 8.75,15.74 J2.2
N$4
  Top 0.152: R3.1 11.73,17.92 F2.2 8.93,17.92 J2.3
N$5  (via drill 0.35)
  Top 0.152: v14.61,18.03 R3.2
  Bottom 0.152: IC1.7 15.62,17.01 v14.61,18.03
N$6  (via drill 0.35)
  Top 0.152: v14.61,15.49 R2.2
  Bottom 0.152: IC1.6 15.62,16.51 v14.61,15.49
N$7
  Bottom 0.152: IC1.1 25.61,11.32 C2.2 Y1.1
N$8
  Bottom 0.152: Y1.2 16.08,11.27 C3.2 19.32,14.51 IC1.2
N$9
  Bottom 0.152: IC1.5 25.59,16 17.77,16 R4.2
N$11
  Top 0.254: J1.1 58.29,11.56 56.9,10.16 49.63,10.16 S3.2 | S3.2
N$12  (via drill 0.35)
  Top 0.152: LED2.1 37.97,17.85 v37.97,17.02
  Bottom 0.152: v37.97,17.02 v37.97,17.01 IC1.30
N$14  (via drill 0.35)
  Top 0.152: LED1.1 38.58,16.01 v37.96,16.01
  Bottom 0.152: v37.96,16.01 IC1.32
N$15
  Top 0.152: R9.1 LED1.2
N$16
  Top 0.152: R10.1 LED2.2
N$20
  Top 0.152: IC3.1 36.58,7.76 | 36.58,7.76 37.77,7.76 R15.2 | R14.1 36.58,7.76
RX  (via drill 0.35)
  Top 0.152: v50.93,20.57 50.93,19.05 53.98,16 57.02,16 J1.5
  Bottom 0.152: IC4.11 46.74,22.61 48.77,20.57 v50.93,20.57
SWCLK  (via drill 0.35)
  Top 0.152: v48.01,19.43 52.7,14.73 J1.4
  Bottom 0.152: IC4.3 v48.01,19.43
SWDIO  (via drill 0.35)
  Top 0.152: v44.2,16.76 48.13,16.76 52.7,12.19 J1.2
  Bottom 0.152: IC4.6 v44.2,16.76
TCK  (via drill 0.35)
  Top 0.152: v49.02,19.56 47.88,20.7 40.89,20.7 40.01,21.59 v25.53,21.59
  Bottom 0.152: IC1.13 26.51,21.59 v25.53,21.59 21.34,21.59 19.05,19.3 9.65,19.3 J3.1 | IC4.2 49.28,19.3 v49.02,19.56 49.02,19.57 45.47,23.13 IC4.10
TDI  (via drill 0.35)
  Top 0.152: J3.2 9.14,22.35 18.54,22.35 18.8,22.1 v24.89,22.1 40.39,22.1 41.27,21.21 46.19,21.21 R11.1 48.86,22.1 v49.28,22.1
  Bottom 0.152: IC1.14 27.56,21.04 27.56,21.84 27.3,22.1 v24.89,22.1 | v49.28,22.1 IC4.13
TDO  (via drill 0.35)
  Top 0.152: v25.53,22.61 v25.54,22.61 40.77,22.61 41.66,21.73 v45.47,21.73 46.27,22.53 R11.2
  Bottom 0.152: IC1.15 28.07,21.03 28.07,21.97 27.43,22.61 v25.53,22.61 21.59,22.61 18.82,19.84 11.66,19.84 J3.3 | IC4.5 v45.47,21.73
TX  (via drill 0.35)
  Top 0.152: v42.93,24.89 54.86,24.89 59.94,19.81 59.94,16.38 J1.3
  Bottom 0.152: IC4.8 v42.93,24.89
V_BUS  (via drill 0.35)
  Top 0.254: FB1.2 7.49,6.67 C16.1 | C16.1 IC2.1 | C16.1 7.74,3.11 IC2.3 9.02,3.09 v9.02,2.03
  Bottom 0.254: v9.02,2.03 9.61,1.44 R7.1 35.69,1.44 R8.2 39.98,2.07 C4.1
VBUSDTCT
  Bottom 0.254: R8.1 36.32,5.59 | 36.32,5.59 36.32,10.29 32.77,13.84 32.77,16.13 33.15,16.51 IC1.31 | J4.8 52.07,1.02 45.47,1.02 40.89,5.59 36.32,5.59
VCCA
  Bottom 0.254: IC1.37 32.59,5.69 C6.1
VCCD  (via drill 0.35)
  Top 0.254: IC3.6 32.58,7.72 C19.1 | R14.2 36.23,4.45 33.4,4.45 32.58,5.27 C19.1 | FB2.1 27.48,3.23 v29.84,5.59 | 29.84,5.63 R12.2 28.3,6.82 FB3.1 27.43,11.7 R13.2 28.31,12.04 R5.2 R6.1 28.31,19.04 29.46,20.19 39.62,20.19 45.47,14.35 v45.72,14.35 | 29.84,5.63 v29.84,5.59 | C12.1 C11.1 29.48,5.22 v29.84,5.59 | C19.1 32.54,5.63 29.84,5.63
  Bottom 0.254: v29.84,5.59 31.59,7.34 IC1.39 | IC4.14 50.72,23.5 C17.1 53.28,15.18 50.23,12.13 C18.1 48.75,12.14 IC5.5 48.69,14.35 v45.72,14.35
VCCIO  (via drill 0.35)
  Top 0.254: R6.2 30.01,17.65 31.85,19.5 | 31.85,19.5 v31.85,19.51 | R9.2 33.57,16.31 R10.2 32.55,18.8 31.85,19.5
  Bottom 0.152: C13.1 23.38,19.51
  Bottom 0.254: IC1.24 32.59,20.12 31.98,19.51 v31.85,19.51 28.07,19.51 | 28.07,19.51 25.61,19.51 | 25.61,19.51 IC1.12 | IC1.46 28.09,19.48 28.07,19.51 | 23.38,19.51 25.61,19.51
VCORE
  Bottom 0.254: IC1.38 32.13,12.49 32.13,5.78 C5.1
VPHY  (via drill 0.35)
  Top 0.152: FB3.2 23.77,8.34 C9.1
  Top 0.254: v22.1,15.49 22.1,9.46 C9.1 C10.1
  Bottom 0.254: IC1.3 25.58,14.99 22.61,14.99 v22.1,15.49
VPLL  (via drill 0.35)
  Top 0.254: v23.37,17.53 18.16,12.32 18.16,3.81 18.86,3.11 C8.1 C7.1 25.35,3.11 FB2.2
  Bottom 0.254: IC1.8 23.38,17.51 v23.37,17.53
VPOW  (via drill 0.35)
  Top 0.254: IC2.5 C15.1 | v9.14,13.34 10.67,13.34 12.81,11.2 12.81,6.28 13.97,5.12 C15.1 | S3.3 53.09,4.22 J4.7 55.12,6.6 60.96,6.6 61.98,5.59 61.98,1.52 61.09,0.64 v42.55,0.64 | v18.74,0.63 14.35,5.01 C15.1
  Bottom 0.254: J3.10 16.76,22.86 6.99,22.86 6.48,22.35 6.48,20.07 9.14,17.4 v9.14,13.34 | v18.74,0.63 v18.75,0.64 v42.55,0.64
VREGIN
  Bottom 0.254: R7.2 27.61,4.57 31.09,8.06 IC1.40

### Text on the board
tPlace: OFF | BRD_PWR | ON | RESET
bPlace: JLCJLCJLCJLC